# Altium schematic sheet Page 2.SchDoc
size 594 x 420 mm; Address1: Address1; Address2: Address2; Address3: Address3; Address4: Address4; DocumentNumber: НЭС.185014.2017-5.1; SheetNumber: 2; SheetTotal: 3; Scale: 1:1; DocumentType: Схема электрическая принципиальная; FirstReferrence: НЭС.185014.2017-5.1
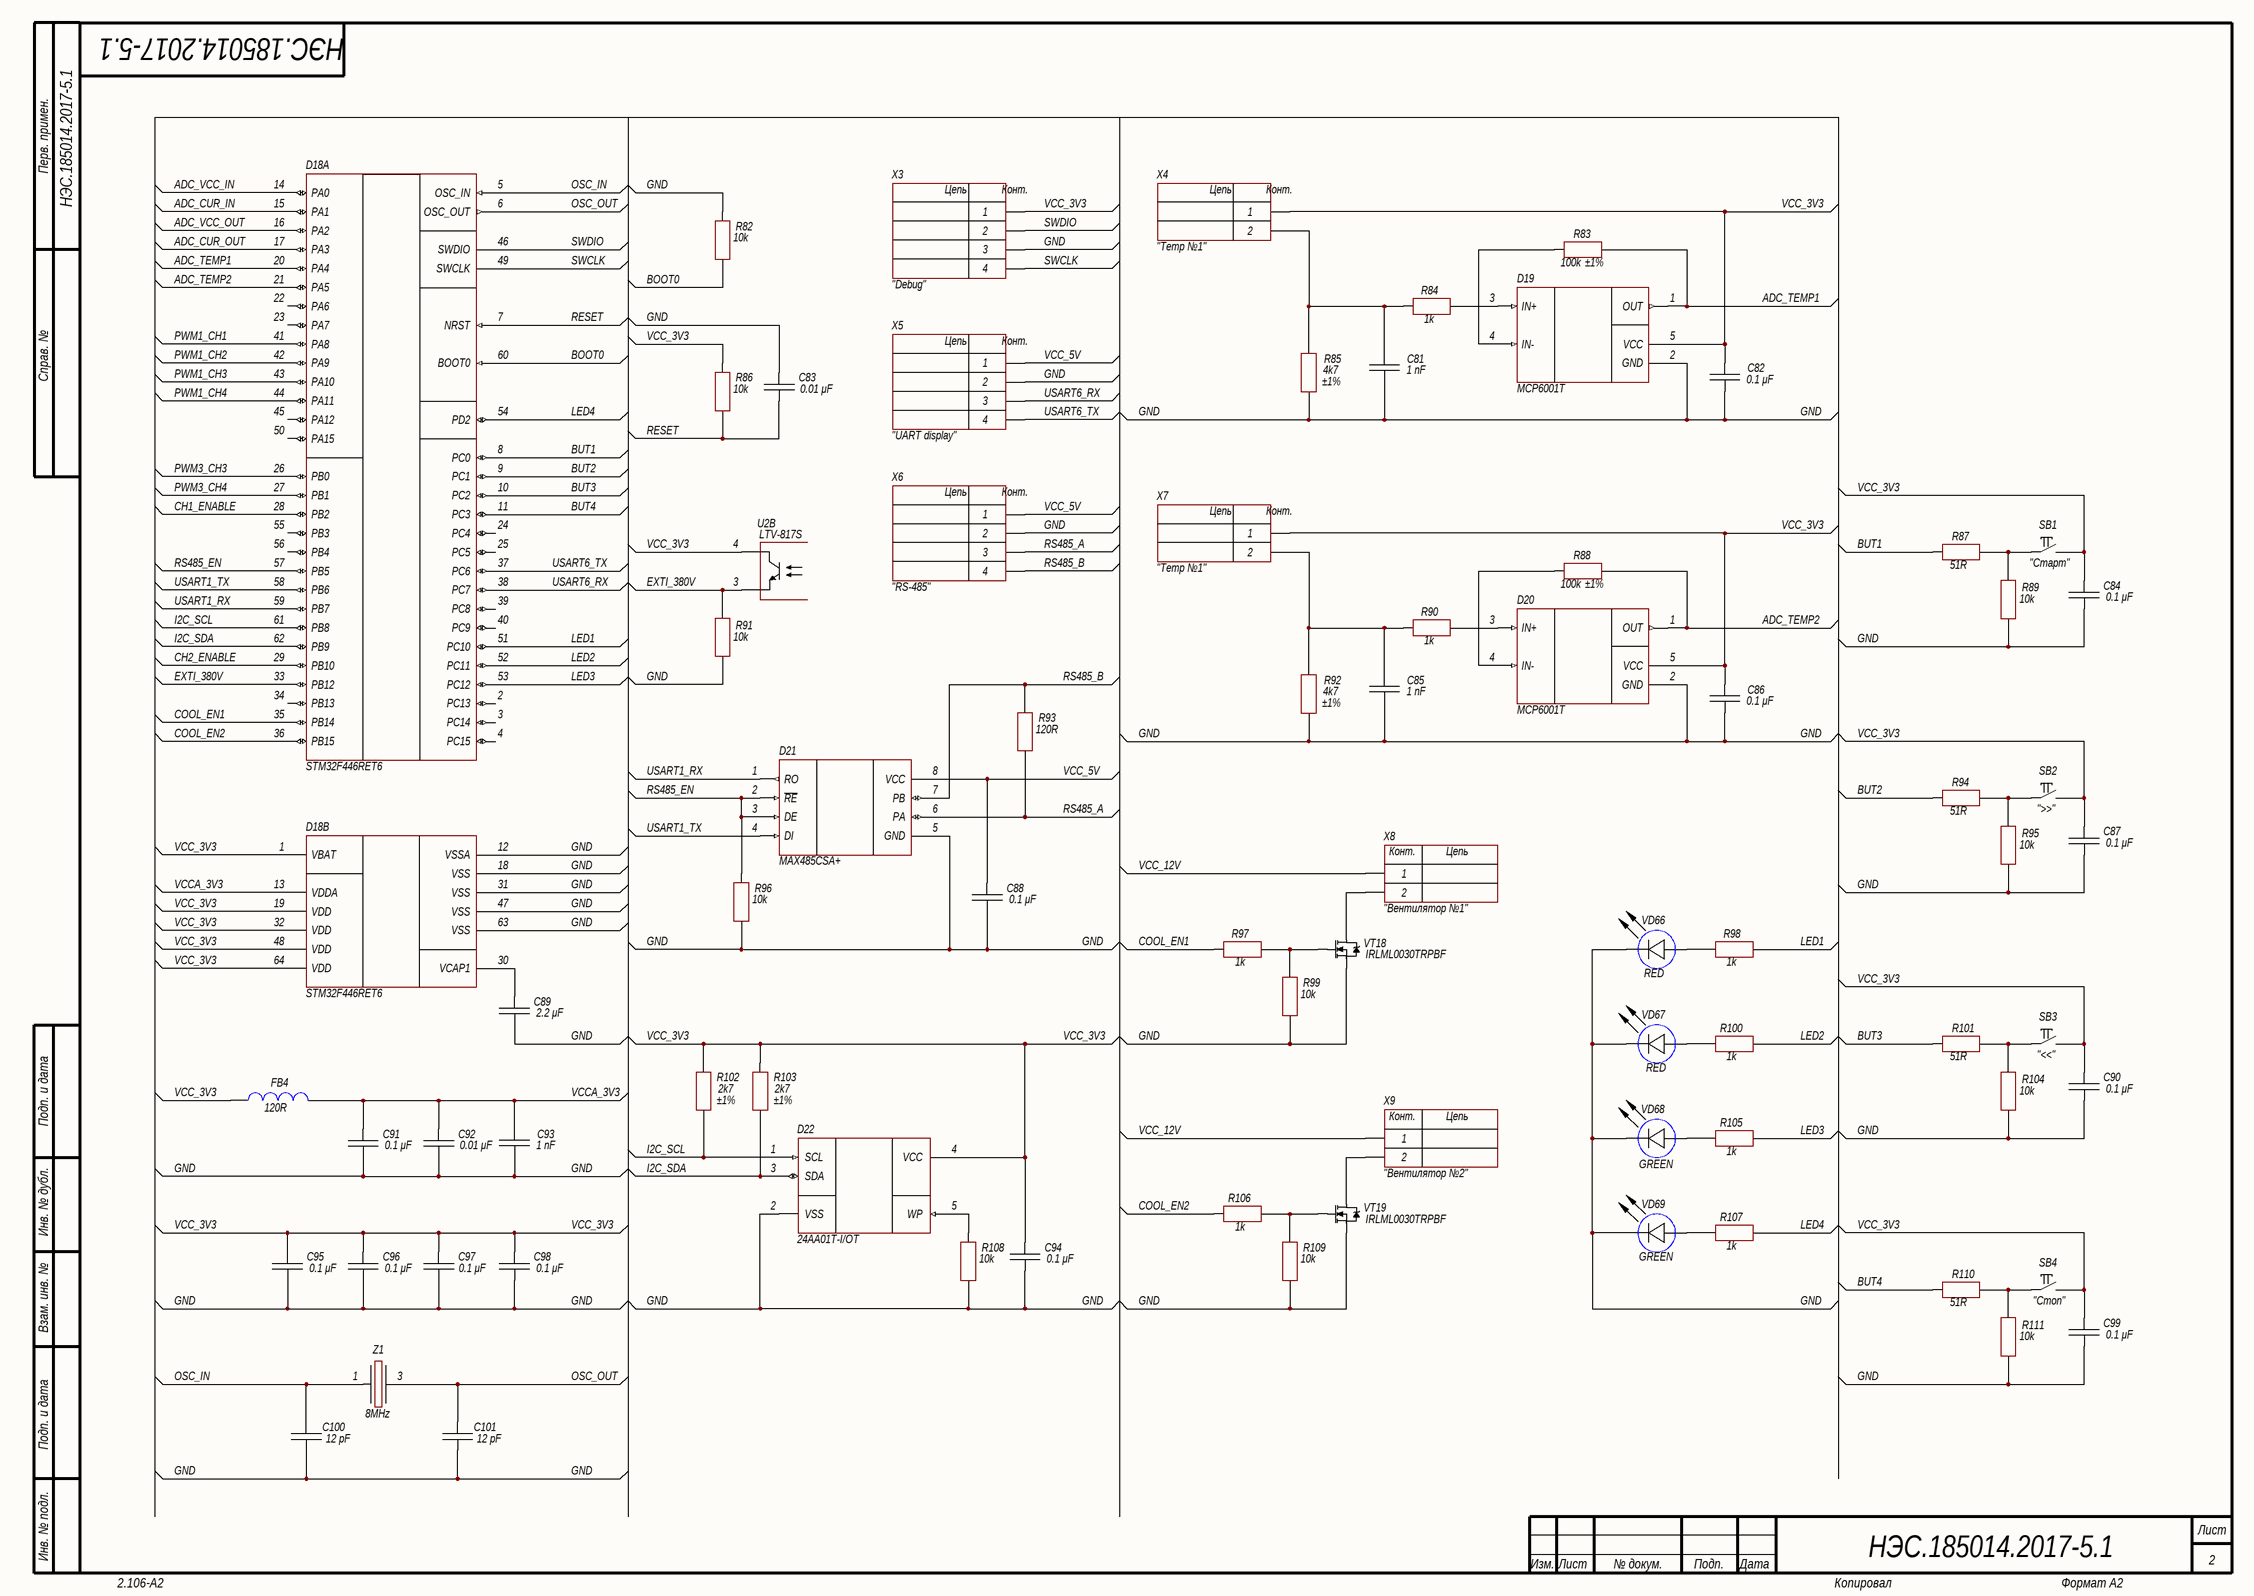
[diagram p0: Page 2.SchDoc]

## Parts
C81  1 nF  [CH0805C]
C82  0.1 μF  [CH0805C]
C83  0.01 μF  [CH0805C]
C84  0.1 μF  [CH0805C]
C85  1 nF  [CH0805C]
C86  0.1 μF  [CH0805C]
C87  0.1 μF  [CH0805C]
C88  0.1 μF  [CH0805C]
C89  2.2 μF  [CH0805C]
C90  0.1 μF  [CH0805C]
C91  0.1 μF  [CH0805C]
C92  0.01 μF  [CH0805C]
C93  1 nF  [CH0805C]
C94  0.1 μF  [CH0805C]
C95  0.1 μF  [CH0805C]
C96  0.1 μF  [CH0805C]
C97  0.1 μF  [CH0805C]
C98  0.1 μF  [CH0805C]
C99  0.1 μF  [CH0805C]
C100  12 pF  [CH0805C]
C101  12 pF  [CH0805C]
D18  STM32F446RET6  [64-LQFP]  (parts A,B of 2)
D19  MCP6001T  [SOT23-5]
D20  MCP6001T  [SOT23-5]
D21  MAX485CSA+  [8-SOIC]
D22  24AA01T-I/OT  [SOT23-5]
FB4  120R  [CH0805L]
R82  10k  [CH0805R]
R83  100k  ComponentKind: ±1%  [CH0805R]
R84  1k  [CH0805R]
R85  4k7  ComponentKind: ±1%  [CH0805R]
R86  10k  [CH0805R]
R87  51R  [CH0805R]
R88  100k  ComponentKind: ±1%  [CH0805R]
R89  10k  [CH0805R]
R90  1k  [CH0805R]
R91  10k  [CH0805R]
R92  4k7  ComponentKind: ±1%  [CH0805R]
R93  120R  [CH0805R]
R94  51R  [CH0805R]
R95  10k  [CH0805R]
R96  10k  [CH0805R]
R97  1k  [CH0805R]
R98  1k  [CH0805R]
R99  10k  [CH0805R]
R100  1k  [CH0805R]
R101  51R  [CH0805R]
R102  2k7  ComponentKind: ±1%  [CH0805R]
R103  2k7  ComponentKind: ±1%  [CH0805R]
R104  10k  [CH0805R]
R105  1k  [CH0805R]
R106  1k  [CH0805R]
R107  1k  [CH0805R]
R108  10k  [CH0805R]
R109  10k  [CH0805R]
R110  51R  [CH0805R]
R111  10k  [CH0805R]
SB1  "Старт"  [BUT: 6x6 SMD]
SB2  ">>"  [BUT: 6x6 SMD]
SB3  "<<"  [BUT: 6x6 SMD]
SB4  "Стоп"  [BUT: 6x6 SMD]
U2  LTV-817S  [4-SMD]  (part B of 2)
VD66  RED  [CH0805LR]
VD67  RED  [CH0805LR]
VD68  GREEN  [CH0805LG]
VD69  GREEN  [CH0805LG]
VT18  IRLML0030TRPBF  [SOT23_123]
VT19  IRLML0030TRPBF  [SOT23_123]
X3  "Debug"  [CON: PLD-4]
X4  "Temp №1"  [CON: WF-02]
X5  "UART display"  [CON: WF-04]
X6  "RS-485"  [CON: WF-04]
X7  "Temp №1"  [CON: WF-02]
X8  "Вентилятор №1"  [CON: WF-02]
X9  "Вентилятор №2"  [CON: WF-02]
Z1  8MHz  [OSC: 5032]

## Nets
ADC_CUR_IN: D18.15(PA1)
ADC_CUR_OUT: D18.17(PA3)
ADC_TEMP1: D18.20(PA4) D19.1(OUT) R83.2
ADC_TEMP2: D18.21(PA5) D20.1(OUT) R88.2
ADC_VCC_IN: D18.14(PA0)
ADC_VCC_OUT: D18.16(PA2)
BOOT0: D18.60(BOOT0) R82.1
BUT1: D18.8(PC0) R87.2
BUT2: D18.9(PC1) R94.2
BUT3: D18.10(PC2) R101.2
BUT4: D18.11(PC3) R110.2
CH1_ENABLE: D18.28(PB2)
CH2_ENABLE: D18.29(PB10)
COOL_EN1: D18.35(PB14) R97.2
COOL_EN2: D18.36(PB15) R106.2
EXTI_380V: D18.33(PB12) R91.2 U2.3(E)
GND: C81.1 C82.1 C83.2 C84.1 C85.1 C86.1 C87.1 C88.1 C89.1 C90.1 C91.1 C92.1 C93.1 C94.1 C95.1 C96.1 C97.1 C98.1 C99.1 C100.1 C101.1 D18.12(VSSA) D18.18(VSS) D18.31(VSS) D18.47(VSS) D18.63(VSS) D19.2(GND) D20.2(GND) D21.5(GND) D22.2(VSS) R82.2 R85.1 R89.1 R91.1 R92.1 R95.1 R96.1 R99.1 R104.1 R108.1 R109.1 R111.1 VD66.2(C) VD67.2(C) VD68.2(C) VD69.2(C) VT18.3(S) VT19.3(S) X3.3 X5.2 X6.2
I2C_SCL: D18.61(PB8) D22.1(SCL) R102.2
I2C_SDA: D18.62(PB9) D22.3(SDA) R103.2
LED1: D18.51(PC10) R98.1
LED2: D18.52(PC11) R100.1
LED3: D18.53(PC12) R105.1
LED4: D18.54(PD2) R107.1
OSC_IN: C100.2 D18.5(OSC_IN) Z1.1
OSC_OUT: C101.2 D18.6(OSC_OUT) Z1.3
PWM1_CH1: D18.41(PA8)
PWM1_CH2: D18.42(PA9)
PWM1_CH3: D18.43(PA10)
PWM1_CH4: D18.44(PA11)
PWM3_CH3: D18.26(PB0)
PWM3_CH4: D18.27(PB1)
RESET: C83.1 D18.7(NRST) R86.1
RS485_A: D21.6(PA) R93.1 X6.3
RS485_B: D21.7(PB) R93.2 X6.4
RS485_EN: D18.57(PB5) D21.2(~{RE}) D21.3(DE) R96.2
SWCLK: D18.49(SWCLK) X3.4
SWDIO: D18.46(SWDIO) X3.2
USART1_RX: D18.59(PB7) D21.1(RO)
USART1_TX: D18.58(PB6) D21.4(DI)
USART6_RX: D18.38(PC7) X5.3
USART6_TX: D18.37(PC6) X5.4
VCC_3V3: C82.2 C84.2 C86.2 C87.2 C90.2 C94.2 C95.2 C96.2 C97.2 C98.2 C99.2 D18.1(VBAT) D18.19(VDD) D18.32(VDD) D18.48(VDD) D18.64(VDD) D19.5(VCC) D20.5(VCC) D22.4(VCC) FB4.2 R86.2 R102.1 R103.1 SB1.2 SB2.2 SB3.2 SB4.2 U2.4(C) X3.1 X4.1 X7.1
VCC_5V: C88.2 D21.8(VCC) X5.1 X6.1
VCC_12V: X8.1 X9.1
VCCA_3V3: C91.2 C92.2 C93.2 D18.13(VDDA) FB4.1
NetC81_2: C81.2 R84.2 R85.2 X4.2
NetC85_2: C85.2 R90.2 R92.2 X7.2
NetC89_2: C89.2 D18.30(VCAP1)
NetD19_3: D19.3(IN+) R84.1
NetD19_4: D19.4(IN-) R83.1
NetD20_3: D20.3(IN+) R90.1
NetD20_4: D20.4(IN-) R88.1
NetD22_5: D22.5(WP) R108.2
NetR87_1: R87.1 R89.2 SB1.1
NetR94_1: R94.1 R95.2 SB2.1
NetR97_1: R97.1 R99.2 VT18.1(G)
NetR98_2: R98.2 VD66.1(A)
NetR100_2: R100.2 VD67.1(A)
NetR101_1: R101.1 R104.2 SB3.1
NetR105_2: R105.2 VD68.1(A)
NetR106_1: R106.1 R109.2 VT19.1(G)
NetR107_2: R107.2 VD69.1(A)
NetR110_1: R110.1 R111.2 SB4.1
NetVT18_2: VT18.2(D) X8.2
NetVT19_2: VT19.2(D) X9.2

Not connected (* = marked no-connect by the designer): D18 2(PC13) 3(PC14) 4(PC15) 22(PA6) 23(PA7) 24(PC4) 25(PC5) 34(PB13) 39(PC8) 40(PC9) 45(PA12) 50(PA15) 55(PB3) 56(PB4)

## Notes on the sheet
- Перв. примен.
- Справ. №
- Подп. и дата
- Инв. № дубл.
- Взам. инв. №
- Инв. № подл.
- Изм.
- Лист
- № докум.
- Подп.
- Дата
- 2.106-A2
- Копировал
- Формат А2
- (in symbol 2-Connector) Цепь; Конт.
- (in symbol 4-Connector) Цепь; Конт.

## Library data of the parts
C81 C85 C93 = Capacitor: Manufacturer: Yageo; Model: CC0805KRX7R9BB102; HelpURL: https://www.digikey.com/product-detail/en/yageo/CC0805KRX7R9BB102/311-1127-1-ND/303037; ComponentKind: X7R; Value: 1 nF
C82-C84 C86-C88 C90-C92 C94-C99 = Capacitor: Manufacturer: Yageo; Model: CC0805KRX7R8BB104; HelpURL: https://www.digikey.com/product-detail/en/yageo/CC0805KRX7R8BB104/311-1141-1-ND/303051; ComponentKind: X7R
  C82 C84 C86-C88 C90 C91 C94-C99: Value: 0.1 μF
  C83 C92: Value: 0.01 μF
C89 = Capacitor: Manufacturer: Yageo; Model: CC0805KKX7R6BB225; HelpURL: https://www.digikey.com/product-detail/en/yageo/CC0805KKX7R6BB225/311-1368-1-ND/2103152; ComponentKind: X7R; Value: 2.2 μF
C100 C101 = Capacitor: Manufacturer: Yageo; Model: CC0805JRNPO9BN120; HelpURL: https://www.digikey.com/product-detail/en/yageo/CC0805JRNPO9BN120/311-1100-1-ND/303010; ComponentKind: NP0; Value: 12 pF
D18 = STM32F446RET6: Cortex-M4; Manufacturer: STMicroelectronics; Model: STM32F446RET6; HelpURL: https://www.digikey.com/product-detail/en/stmicroelectronics/STM32F446RET6/497-15376-ND/5175962; ComponentKind: 64-LQFP
D19 D20 = MCP6001T: OP amplifier; Manufacturer: Microchip Technology; Model: MCP6001T-I/OT; HelpURL: https://www.digikey.com/product-detail/en/microchip-technology/MCP6001T-I-OT/MCP6001T-I-OTCT-ND/697158; ComponentKind: SOT23-5
D21 = MAX485CSA+: RS485; Manufacturer: Maxim Integrated; Model: MAX485CSA+; HelpURL: https://www.digikey.com/product-detail/en/maxim-integrated/MAX485CSA/MAX485CSA-ND/948027; ComponentKind: 8-SOIC
D22 = 24AA01T-I/OT: EEPROM; Manufacturer: Microchip Technology; Model: 24AA01T-I/OT; HelpURL: https://www.digikey.com/product-detail/en/microchip-technology/24AA01T-I-OT/24AA01T-I-OTCT-ND/857670; ComponentKind: SOT23-5
FB4 = Inductor: Manufacturer: Murata Electronics North America; Model: BLM21PG121SN1D; HelpURL: https://www.digikey.com/product-detail/en/murata-electronics-north-america/BLM21PG121SN1D/490-5986-1-ND/3845186; ComponentKind: 0805; Value: 120R
R82 R86 R89 R91 R95 R96 R99 R104 R108 R109 R111 = Resistor: Manufacturer: Yageo; Model: RC0805JR-0710KL; HelpURL: https://www.digikey.com/product-detail/en/yageo/RC0805JR-0710KL/311-10KARCT-ND/731188; ComponentKind: 0805; Value: 10k
R83 R88 = Resistor: Manufacturer: Yageo; Model: RC0805FR-07100KL; HelpURL: https://www.digikey.com/product-detail/en/yageo/RC0805FR-07100KL/311-100KCRCT-ND/730491; Value: 100k
R84 R90 R97 R98 R100 R105-R107 = Resistor: Manufacturer: Yageo; Model: RC0805JR-071KL; HelpURL: https://www.digikey.com/product-detail/en/yageo/RC0805JR-071KL/311-1.0KARCT-ND/731165; ComponentKind: 0805; Value: 1k
R85 R92 = Resistor: Manufacturer: Yageo; Model: RC0805FR-074K7L; HelpURL: https://www.digikey.com/product-detail/en/yageo/RC0805FR-074K7L/311-4.70KCRCT-ND/730876; Value: 4k7
R87 R94 R101 R110 = Resistor: Manufacturer: Yageo; Model: RC0805JR-0751RL; HelpURL: https://www.digikey.com/product-detail/en/yageo/RC0805JR-0751RL/311-51ARCT-ND/731292; ComponentKind: 0805; Value: 51R
R93 = Resistor: Manufacturer: Yageo; Model: RC0805JR-07120RL; HelpURL: https://www.digikey.com/product-detail/en/yageo/RC0805JR-07120RL/311-120ARCT-ND/731194; ComponentKind: 0805; Value: 120R
R102 R103 = Resistor: Manufacturer: Yageo; Model: RC0805FR-072K7L; HelpURL: https://www.digikey.com/product-detail/en/yageo/RC0805FR-072K7L/311-2.70KCRCT-ND/730653; Value: 2k7
SB1-SB4 = Tactile switches: 6x6 mm; Manufacturer: KLS; Model: L-KLS7-TS6604-4.3-180-B; HelpURL: https://www.chipdip.ru/product/kls7-ts6604-4.3-180-b-it-1102s; ComponentKind: 6x6mm
U2 = Optoisolator: Manufacturer: Lite-On Inc.; Model: LTV-817S; HelpURL: https://www.digikey.com/product-detail/en/lite-on-inc/LTV-817S/160-1367-5-ND/385837; ComponentKind: 4-SMD
VD66 VD67 = LED: Manufacturer: Lite-On Inc.; Model: LTST-C171KRKT; HelpURL: https://www.digikey.com/product-detail/en/lite-on-inc/LTST-C171KRKT/160-1427-1-ND/386800; ComponentKind: 0805; Value: RED
VD68 VD69 = LED: Manufacturer: Lite-On Inc.; Model: LTST-C171GKT; HelpURL: https://www.digikey.com/product-detail/en/lite-on-inc/LTST-C171GKT/160-1423-1-ND/386792; ComponentKind: 0805; Value: GREEN
VT18 VT19 = N-chanel: Mosfet; Manufacturer: Infineon Technologies; Model: IRLML0030TRPBF; ComponentKind: SOT-23; HelpURL: https://www.digikey.com/product-detail/en/infineon-technologies/IRLML0030TRPBF/IRLML0030TRPBFCT-ND/2202231
X3 = 4-Connector: Model: PLD-4; Manufacturer: *; HelpURL: *; ComponentKind: *
X4 X7-X9 = 2-Connector: Model: WF-02; Manufacturer: *; HelpURL: *; ComponentKind: *
X5 X6 = 4-Connector: Model: WF-04; Manufacturer: *; HelpURL: *; ComponentKind: *
Z1 = Oscillator: Manufacturer: Geyer; Model: KX-9A; HelpURL: http://www.electronshik.ru/item/kx-9a-80-mhz-209499; ComponentKind: 5032; Value: 8MHz